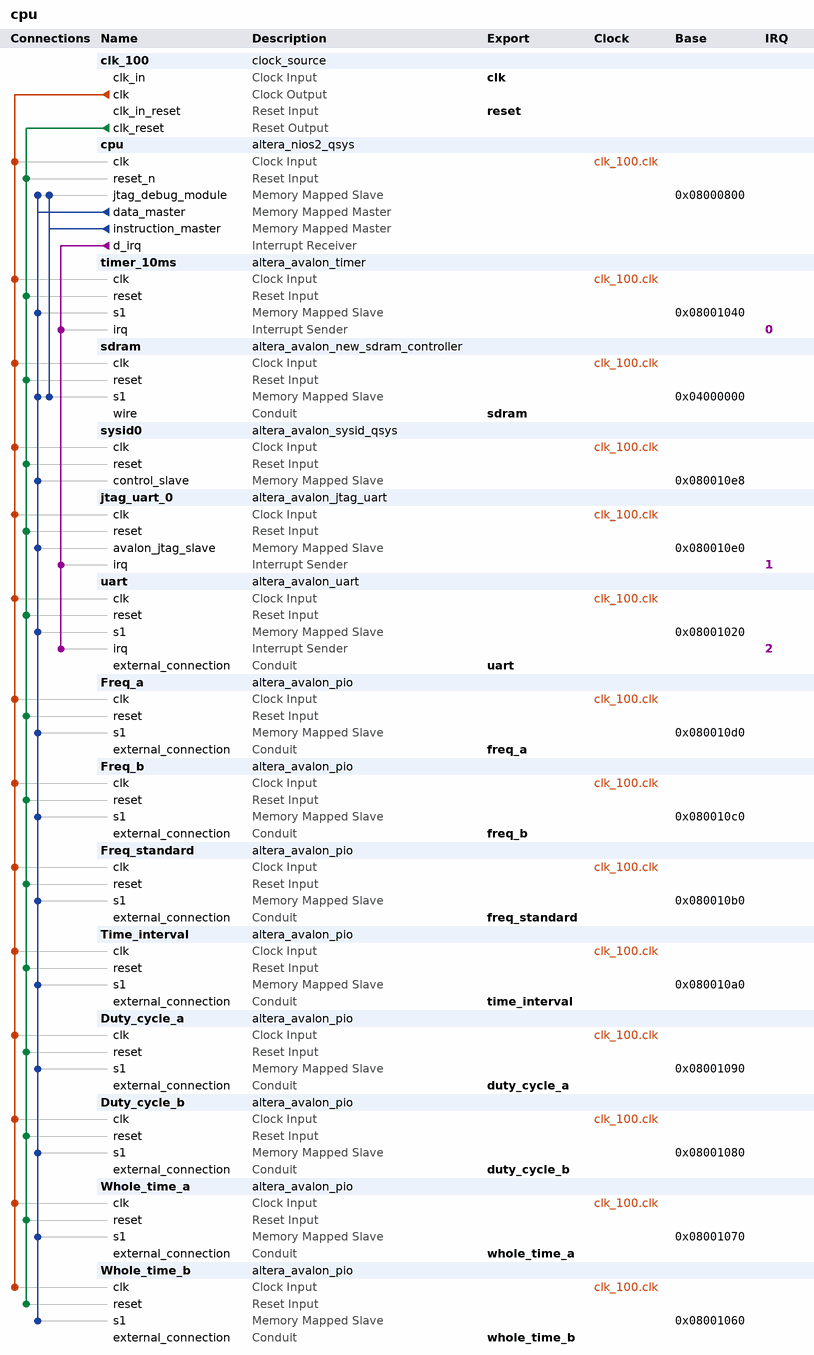
[diagram p0: system contents]
# Platform Designer (Qsys) system cpu, Cyclone V 5CSEMA5F31C6
# Parameters at their usual value, and those the tool derives, are not listed.
package require -exact qsys 13.1
create_system cpu
set_project_property DEVICE_FAMILY {Cyclone V}
set_project_property DEVICE 5CSEMA5F31C6

add_instance clk_100 clock_source 13.1
set_instance_parameter_value clk_100 clockFrequency 100000000

add_instance cpu altera_nios2_qsys 13.1
set_instance_parameter_value cpu resetSlave sdram.s1
set_instance_parameter_value cpu mmu_TLBMissExcSlave None
set_instance_parameter_value cpu exceptionSlave sdram.s1
set_instance_parameter_value cpu breakSlave cpu.jtag_debug_module
set_instance_parameter_value cpu impl Fast
set_instance_parameter_value cpu icache_size 4096

add_instance timer_10ms altera_avalon_timer 13.1
set_instance_parameter_value timer_10ms period 10
set_instance_parameter_value timer_10ms periodUnits MSEC

add_instance sdram altera_avalon_new_sdram_controller 13.1
set_instance_parameter_value sdram TAC 5.5
set_instance_parameter_value sdram TRCD 20.0
set_instance_parameter_value sdram TRP 20.0
set_instance_parameter_value sdram casLatency 3
set_instance_parameter_value sdram columnWidth 10
set_instance_parameter_value sdram dataWidth 16
set_instance_parameter_value sdram generateSimulationModel true
set_instance_parameter_value sdram model single_Micron_MT48LC4M32B2_7_chip
set_instance_parameter_value sdram numberOfBanks 4
set_instance_parameter_value sdram numberOfChipSelects 1
set_instance_parameter_value sdram powerUpDelay 100.0
set_instance_parameter_value sdram refreshPeriod 7.8125
set_instance_parameter_value sdram rowWidth 13

add_instance sysid0 altera_avalon_sysid_qsys 13.1
set_instance_parameter_value sysid0 id 2

add_instance jtag_uart_0 altera_avalon_jtag_uart 13.1
set_instance_parameter_value jtag_uart_0 simInteractiveOptions NO_INTERACTIVE_WINDOWS

add_instance uart altera_avalon_uart 13.1
set_instance_parameter_value uart baud 9600
set_instance_parameter_value uart dataBits 8
set_instance_parameter_value uart fixedBaud true
set_instance_parameter_value uart parity NONE
set_instance_parameter_value uart stopBits 1

add_instance Freq_a altera_avalon_pio 13.1
set_instance_parameter_value Freq_a direction Input
set_instance_parameter_value Freq_a width 32

add_instance Freq_b altera_avalon_pio 13.1
set_instance_parameter_value Freq_b direction Input
set_instance_parameter_value Freq_b width 32

add_instance Freq_standard altera_avalon_pio 13.1
set_instance_parameter_value Freq_standard direction Input
set_instance_parameter_value Freq_standard width 32

add_instance Time_interval altera_avalon_pio 13.1
set_instance_parameter_value Time_interval direction Input
set_instance_parameter_value Time_interval width 32

add_instance Duty_cycle_a altera_avalon_pio 13.1
set_instance_parameter_value Duty_cycle_a direction Input
set_instance_parameter_value Duty_cycle_a width 32

add_instance Duty_cycle_b altera_avalon_pio 13.1
set_instance_parameter_value Duty_cycle_b direction Input
set_instance_parameter_value Duty_cycle_b width 32

add_instance Whole_time_a altera_avalon_pio 13.1
set_instance_parameter_value Whole_time_a direction Input
set_instance_parameter_value Whole_time_a width 32

add_instance Whole_time_b altera_avalon_pio 13.1
set_instance_parameter_value Whole_time_b direction Input
set_instance_parameter_value Whole_time_b width 32

# connections
add_connection clk_100.clk cpu.clk clock
add_connection clk_100.clk Duty_cycle_a.clk clock
add_connection clk_100.clk Duty_cycle_b.clk clock
add_connection clk_100.clk Freq_a.clk clock
add_connection clk_100.clk Freq_b.clk clock
add_connection clk_100.clk Freq_standard.clk clock
add_connection clk_100.clk jtag_uart_0.clk clock
add_connection clk_100.clk sdram.clk clock
add_connection clk_100.clk sysid0.clk clock
add_connection clk_100.clk Time_interval.clk clock
add_connection clk_100.clk timer_10ms.clk clock
add_connection clk_100.clk uart.clk clock
add_connection clk_100.clk Whole_time_a.clk clock
add_connection clk_100.clk Whole_time_b.clk clock
add_connection clk_100.clk_reset cpu.reset_n reset
add_connection clk_100.clk_reset Duty_cycle_a.reset reset
add_connection clk_100.clk_reset Duty_cycle_b.reset reset
add_connection clk_100.clk_reset Freq_a.reset reset
add_connection clk_100.clk_reset Freq_b.reset reset
add_connection clk_100.clk_reset Freq_standard.reset reset
add_connection clk_100.clk_reset jtag_uart_0.reset reset
add_connection clk_100.clk_reset sdram.reset reset
add_connection clk_100.clk_reset sysid0.reset reset
add_connection clk_100.clk_reset Time_interval.reset reset
add_connection clk_100.clk_reset timer_10ms.reset reset
add_connection clk_100.clk_reset uart.reset reset
add_connection clk_100.clk_reset Whole_time_a.reset reset
add_connection clk_100.clk_reset Whole_time_b.reset reset
add_connection cpu.data_master cpu.jtag_debug_module avalon
set_connection_parameter_value cpu.data_master/cpu.jtag_debug_module baseAddress 0x08000800
add_connection cpu.data_master Duty_cycle_a.s1 avalon
set_connection_parameter_value cpu.data_master/Duty_cycle_a.s1 baseAddress 0x08001090
add_connection cpu.data_master Duty_cycle_b.s1 avalon
set_connection_parameter_value cpu.data_master/Duty_cycle_b.s1 baseAddress 0x08001080
add_connection cpu.data_master Freq_a.s1 avalon
set_connection_parameter_value cpu.data_master/Freq_a.s1 baseAddress 0x080010d0
add_connection cpu.data_master Freq_b.s1 avalon
set_connection_parameter_value cpu.data_master/Freq_b.s1 baseAddress 0x080010c0
add_connection cpu.data_master Freq_standard.s1 avalon
set_connection_parameter_value cpu.data_master/Freq_standard.s1 baseAddress 0x080010b0
add_connection cpu.data_master jtag_uart_0.avalon_jtag_slave avalon
set_connection_parameter_value cpu.data_master/jtag_uart_0.avalon_jtag_slave baseAddress 0x080010e0
add_connection cpu.data_master sdram.s1 avalon
set_connection_parameter_value cpu.data_master/sdram.s1 baseAddress 0x04000000
add_connection cpu.data_master sysid0.control_slave avalon
set_connection_parameter_value cpu.data_master/sysid0.control_slave baseAddress 0x080010e8
add_connection cpu.data_master Time_interval.s1 avalon
set_connection_parameter_value cpu.data_master/Time_interval.s1 baseAddress 0x080010a0
add_connection cpu.data_master timer_10ms.s1 avalon
set_connection_parameter_value cpu.data_master/timer_10ms.s1 baseAddress 0x08001040
add_connection cpu.data_master uart.s1 avalon
set_connection_parameter_value cpu.data_master/uart.s1 baseAddress 0x08001020
add_connection cpu.data_master Whole_time_a.s1 avalon
set_connection_parameter_value cpu.data_master/Whole_time_a.s1 baseAddress 0x08001070
add_connection cpu.data_master Whole_time_b.s1 avalon
set_connection_parameter_value cpu.data_master/Whole_time_b.s1 baseAddress 0x08001060
add_connection cpu.instruction_master cpu.jtag_debug_module avalon
set_connection_parameter_value cpu.instruction_master/cpu.jtag_debug_module baseAddress 0x08000800
add_connection cpu.instruction_master sdram.s1 avalon
set_connection_parameter_value cpu.instruction_master/sdram.s1 baseAddress 0x04000000
add_connection cpu.d_irq jtag_uart_0.irq interrupt
set_connection_parameter_value cpu.d_irq/jtag_uart_0.irq irqNumber 1
add_connection cpu.d_irq timer_10ms.irq interrupt
set_connection_parameter_value cpu.d_irq/timer_10ms.irq irqNumber 0
add_connection cpu.d_irq uart.irq interrupt
set_connection_parameter_value cpu.d_irq/uart.irq irqNumber 2

# exported interfaces
add_interface clk clock sink
set_interface_property clk EXPORT_OF clk_100.clk_in
add_interface reset reset sink
set_interface_property reset EXPORT_OF clk_100.clk_in_reset
add_interface sdram conduit end
set_interface_property sdram EXPORT_OF sdram.wire
add_interface uart conduit end
set_interface_property uart EXPORT_OF uart.external_connection
add_interface freq_a conduit end
set_interface_property freq_a EXPORT_OF Freq_a.external_connection
add_interface freq_b conduit end
set_interface_property freq_b EXPORT_OF Freq_b.external_connection
add_interface freq_standard conduit end
set_interface_property freq_standard EXPORT_OF Freq_standard.external_connection
add_interface time_interval conduit end
set_interface_property time_interval EXPORT_OF Time_interval.external_connection
add_interface duty_cycle_a conduit end
set_interface_property duty_cycle_a EXPORT_OF Duty_cycle_a.external_connection
add_interface duty_cycle_b conduit end
set_interface_property duty_cycle_b EXPORT_OF Duty_cycle_b.external_connection
add_interface whole_time_a conduit end
set_interface_property whole_time_a EXPORT_OF Whole_time_a.external_connection
add_interface whole_time_b conduit end
set_interface_property whole_time_b EXPORT_OF Whole_time_b.external_connection

set_interconnect_requirement {$system} qsys_mm.clockCrossingAdapter HANDSHAKE
set_interconnect_requirement {$system} qsys_mm.maxAdditionalLatency 1
set_interconnect_requirement {$system} qsys_mm.insertDefaultSlave false

save_system cpu.qsys
